# EAGLE design T08_rc360detector_alt (EAGLE 7.4.0)
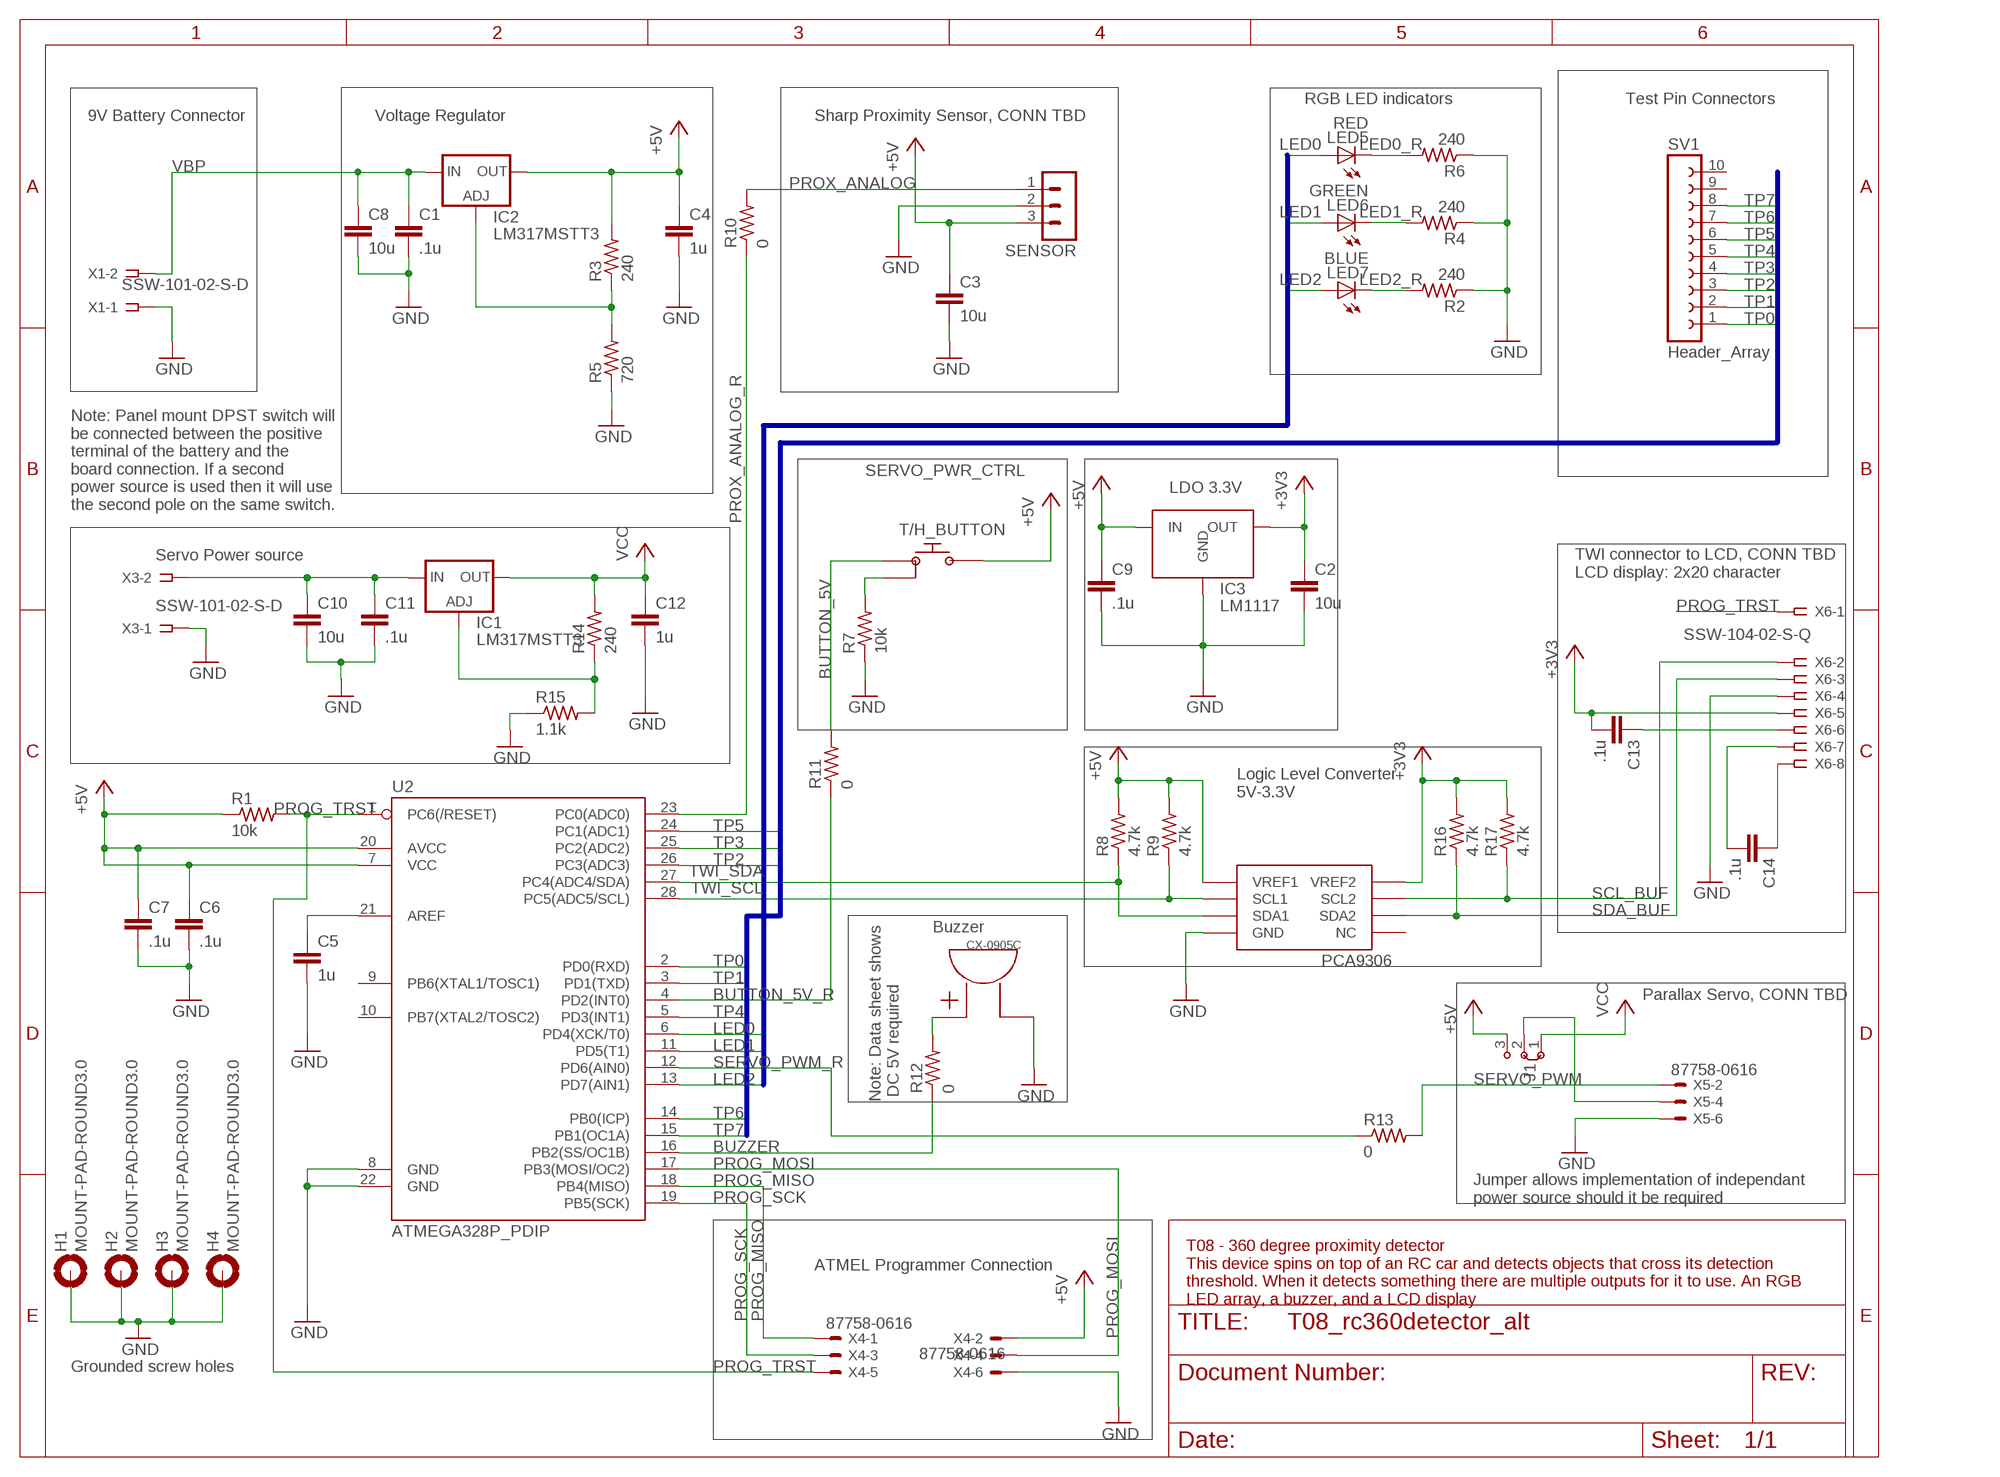
[diagram p0: schematic, sheet 1]

## Parts
C1  .1u  C-EUC0805  [C0805]
C2  10u  C-EUC0805  [C0805]
C3  10u  C-EUC0805  [C0805]
C4  1u  C-EUC0805  [C0805]
C5  1u  C-EUC0805  [C0805]
C6  .1u  C-EUC0805  [C0805]
C7  .1u  C-EUC0805  [C0805]
C8  10u  C-EUC0805  [C0805]
C9  .1u  C-EUC0805  [C0805]
C10  10u  C-EUC0805  [C0805]
C11  .1u  C-EUC0805  [C0805]
C12  1u  C-EUC0805  [C0805]
C13  .1u  C-EUC0805  [C0805]
C14  .1u  C-EUC0805  [C0805]
CX-0905C  CX-0905C  [BUZZER_CX-0905C]
H1  MOUNT-PAD-ROUND3.0  [3,0-PAD]
H2  MOUNT-PAD-ROUND3.0  [3,0-PAD]
H3  MOUNT-PAD-ROUND3.0  [3,0-PAD]
H4  MOUNT-PAD-ROUND3.0  [3,0-PAD]
IC1  LM317MSTT3  [SOT223]
IC2  LM317MSTT3  [SOT223]
IC3  LM1117  [SOT-223]
J1  J2X2MM  [04C]
LED5  RED  LEDLD260  [LD260]
LED6  GREEN  LEDLD260  [LD260]
LED7  BLUE  LEDLD260  [LD260]
PCA9306  PCA9306_BREAKOUT  [PCA9306_BREAKOUT]
R1  10k  R-US_R0805  [R0805]
R2  240  R-US_R0805  [R0805]
R3  240  R-US_R0805  [R0805]
R4  240  R-US_R0805  [R0805]
R5  720  R-US_R0805  [R0805]
R6  240  R-US_R0805  [R0805]
R7  10k  R-US_R0805  [R0805]
R8  4.7k  R-US_R0805  [R0805]
R9  4.7k  R-US_R0805  [R0805]
R10  0  R-US_R0805  [R0805]
R11  0  R-US_R0805  [R0805]
R12  0  R-US_R0805  [R0805]
R13  0  R-US_R0805  [R0805]
R14  240  R-US_R0805  [R0805]
R15  1.1k  R-US_R0805  [R0805]
R16  4.7k  R-US_R0805  [R0805]
R17  4.7k  R-US_R0805  [R0805]
SENSOR  MA03-1  [MA03-1]
SV1  Header_Array  FE10-1  [FE10]
T/H_BUTTON  PR141C  [3_THROUGH_HOLE]
U2  ATMEGA328P_PDIP  [DIL28-3]
X1  SSW-101-02-S-D  [SSW-101-02-S-D]
X3  SSW-101-02-S-D  [SSW-101-02-S-D]
X4  87758-0616  [87758-0616]
X5  87758-0616  [87758-0616]
X6  SSW-104-02-S-Q  [SSW-104-02-S-Q]

## Nets
+3V3: C2.1 C13.2 IC3.VOUT(OUT) PCA9306.VREF2 R16.2 R17.2 X6.5
+5V: C3.1 C4.1 C6.1 C7.1 C9.1 IC2.4(OUT) IC3.IN J1.3 PCA9306.VREF1 R1.1 R3.2 R8.2 R9.2 SENSOR.3 T/H_BUTTON.P$3(OUT) U2.7(VCC) U2.20(AVCC) X4.2
AREF: C5.1 U2.21(AREF)
BUTTON_5V: R11.2 T/H_BUTTON.P$1(IN)
BUTTON_5V_R: R11.1 U2.4(PD2(INT0))
BUZZER: R12.1 U2.16(PB2(SS/OC1B))
GND: C1.2 C2.2 C3.2 C4.2 C5.2 C6.2 C7.2 C8.2 C9.2 C10.2 C11.2 C12.2 CX-0905C.OUT H1.B3,0(MOUNT) H2.B3,0(MOUNT) H3.B3,0(MOUNT) H4.B3,0(MOUNT) IC3.GND PCA9306.GND R2.1 R4.1 R5.1 R6.1 R7.1 R15.1 SENSOR.2 U2.8(GND) U2.22(GND) X1.1 X3.1 X4.6 X5.6 X6.4
LED0: LED5.A U2.6(PD4(XCK/T0))
LED0_R: LED5.K(C) R6.2
LED1: LED6.A U2.11(PD5(T1))
LED1_R: LED6.K(C) R4.2
LED2: LED7.A U2.13(PD7(AIN1))
LED2_R: LED7.K(C) R2.2
N$1: R7.2 T/H_BUTTON.P$2(GND)
N$2: IC2.1(ADJ) R3.1 R5.2
N$4: CX-0905C.IN R12.2
N$13: IC1.1(ADJ) R14.1 R15.2
N$14: C10.1 C11.1 IC1.3(IN) X3.2
N$16: J1.2 X5.4
N$18: C13.1 X6.6
N$19: C14.2 X6.7
N$20: C14.1 X6.8
PROG_MISO: U2.18(PB4(MISO)) X4.1
PROG_MOSI: U2.17(PB3(MOSI/OC2)) X4.4
PROG_SCK: U2.19(PB5(SCK)) X4.3
PROG_TRST: R1.2 U2.1(PC6(/RESET)) X4.5 X6.1
PROX_ANALOG: R10.2 SENSOR.1
PROX_ANALOG_R: R10.1 U2.23(PC0(ADC0))
SCL_BUF: PCA9306.SCL2 R17.1 X6.2
SDA_BUF: PCA9306.SDA2 R16.1 X6.3
SERVO_PWM: R13.2 X5.2
SERVO_PWM_R: R13.1 U2.12(PD6(AIN0))
TP0: SV1.1 U2.2(PD0(RXD))
TP1: SV1.2 U2.3(PD1(TXD))
TP2: SV1.3 U2.26(PC3(ADC3))
TP3: SV1.4 U2.25(PC2(ADC2))
TP4: SV1.5 U2.5(PD3(INT1))
TP5: SV1.6 U2.24(PC1(ADC1))
TP6: SV1.7 U2.14(PB0(ICP))
TP7: SV1.8 U2.15(PB1(OC1A))
TWI_SCL: PCA9306.SCL1 R9.1 U2.28(PC5(ADC5/SCL))
TWI_SDA: PCA9306.SDA1 R8.1 U2.27(PC4(ADC4/SDA))
VBP: C1.1 C8.1 IC2.3(IN) X1.2
VCC: C12.1 IC1.4(OUT) J1.1 R14.2
Unconnected: PCA9306.NC SV1.9 SV1.10 U2.9(PB6(XTAL1/TOSC1)) U2.10(PB7(XTAL2/TOSC2)) X5.1 X5.3 X5.5

## Buses
LED[0..2]
TP[0..13]

## Notes on the sheet
- RGB LED indicators | Test Pin Connectors
- 9V Battery Connector | Voltage Regulator | Sharp Proximity Sensor, CONN TBD
- SERVO_PWR_CTRL
- LDO 3.3V
- Note: Panel mount DPST switch will
  be connected between the positive
  terminal of the battery and the 
  board connection. If a second 
  power source is used then it will use
  the second pole on the same switch.
- Servo Power source
- TWI connector to LCD, CONN TBD
  LCD display: 2x20 character
- Logic Level Converter
  5V-3.3V
- Buzzer
- Parallax Servo, CONN TBD
- Note: Data sheet shows
   DC 5V required
- Jumper allows implementation of independant 
  power source should it be required
- ATMEL Programmer Connection
- T08 - 360 degree proximity detector
  This device spins on top of an RC car and detects objects that cross its detection
  threshold. When it detects something there are multiple outputs for it to use. An RGB 
  LED array, a buzzer, and a LCD display
- Grounded screw holes

## Library data of the parts
C1 C4 C5 C9 C11-C14 = resistor:C-EU: CAPACITOR, European symbol
C2 C3 C6-C8 C10 = rcl:C-EU: CAPACITOR, European symbol
CX-0905C = 360prox:CX-0905C
H1-H4 = holes:MOUNT-PAD-ROUND: MOUNTING PAD, round
IC1 IC2 = v-reg:LM317?*: 500 mA Adjustable Output Positive Voltage Regulator Source: http://www.onsemi.co.jp .. LM317M-D.PDF
IC3 = 360prox:LM1117
J1 = jumper:J2: Jumper switch 2 x 2.5 mm
LED5-LED7 = led:LED: LED OSRAM: - CHIPLED LG R971, LG N971, LY N971, LG Q971, LY Q971, LO R971, LY R971 LH N974, LH R974 LS Q976, LO Q976, LY Q976 LO Q996 - Hyper CHIPLED LW Q18S LB Q993, LB Q99A, LB R99A - SideLED LS A670, LO A670, LY A670, LG A670, LP A670 LB A673, LV A673, LT A673, LW A673 LH A674 LY A675 LS A676, LA A676, LO A676, LY A676, LW A676 LS A679, LY A679, LG A679 - Hyper Micro SIDELED® LS Y876, LA Y876, LO Y876, LY Y876 LT Y87S - SmartLED LW L88C, LW L88S LB L89C, LB L89S, LG L890 LS L89K, LO L89K, LY L89K LS L896, LA L896, LO L896, LY L896 - TOPLED LS T670, LO T670, LY T670, LG T670, LP T670 LSG T670, LSP T670, LSY T670, LOP T670, LYG T670 LG T671, LOG T671, LSG T671 LB T673, LV T673, LT T673, LW T673 LH T674 LS T676, LA T676, LO T676, LY T676, LB T676, LH T676, LSB T676, LW T676 LB T67C, LV T67C, LT T67C, LS T67K, LO T67K, LY T67K, LW E67C LS E67B, LA E67B, LO E67B, LY E67B, LB E67C, LV E67C, LT E67C LW T67C LS T679, LY T679, LG T679 LS T770, LO T770, LY T770, LG T770, LP T770 LB T773, LV T773, LT T773, LW T773 LH T774 LS E675, LA E675, LY E675, LS T675 LS T776, LA T776, LO T776, LY T776, LB T776 LHGB T686 LT T68C, LB T68C - Hyper Mini TOPLED® LB M676 - Mini TOPLED Santana® LG M470 LS M47K, LO M47K, LY M47K Source: http://www.osram.convergy.de LUXEON: - LUMILED® LXK2-PW12-R00, LXK2-PW12-S00, LXK2-PW14-U00, LXK2-PW14-V00 LXK2-PM12-R00, LXK2-PM12-S00, LXK2-PM14-U00 LXK2-PE12-Q00, LXK2-PE12-R00, LXK2-PE12-S00, LXK2-PE14-T00, LXK2-PE14-U00 LXK2-PB12-K00, LXK2-PB12-L00, LXK2-PB12-M00, LXK2-PB14-N00, LXK2-PB14-P00, LXK2-PB14-Q00 LXK2-PR12-L00, LXK2-PR12-M00, LXK2-PR14-Q00, LXK2-PR14-R00 LXK2-PD12-Q00, LXK2-PD12-R00, LXK2-PD12-S00 LXK2-PH12-R00, LXK2-PH12-S00 LXK2-PL12-P00, LXK2-PL12-Q00, LXK2-PL12-R00 Source: www.luxeon.com KINGBRIGHT: KA-3528ASYC Source: www.kingbright.com
PCA9306 = 360prox:PCA9306_BREAKOUT
R1-R17 = rcl:R-US_: RESISTOR, American symbol
SENSOR = con-lstb:MA03-1: PIN HEADER; OC_FARNELL: unknown; OC_NEWARK: unknown
SV1 = con-lsta:FE10-1: FEMALE HEADER; OC_FARNELL: unknown; OC_NEWARK: unknown
T/H_BUTTON = 360prox:PR141C
U2 = SparkFun-DigitalIC:ATMEGA328P_PDIP: uC used in the Arduino 32kb flash, 1k EEPROM, 2k SRAM This is the through-hole version of this chip.
X1 X3 = con-samtec:SSW-101-02-S-D: THROUGH-HOLE .025" SQ POST SOCKET Source: Samtec SSW.pdf; MPN: SSW-101-02-S-D; OC_FARNELL: unknown; OC_NEWARK: 82P1456
X4 X5 = con-molex:87758-0616: 6 Pin - 2mm Dual Row Single Wafer, Vertical T/H HDR Source: http://www.molex.com/pdm_docs/sd/877580616_sd.pdf; MPN: 87758-0616; OC_FARNELL: 7472323; OC_NEWARK: 25M5667
X6 = con-samtec:SSW-104-02-S-Q: THROUGH-HOLE .025" SQ POST SOCKET Source: Samtec SSW.pdf; MPN: SSW-104-02-S-Q; OC_FARNELL: unknown; OC_NEWARK: 82P2475

## Board
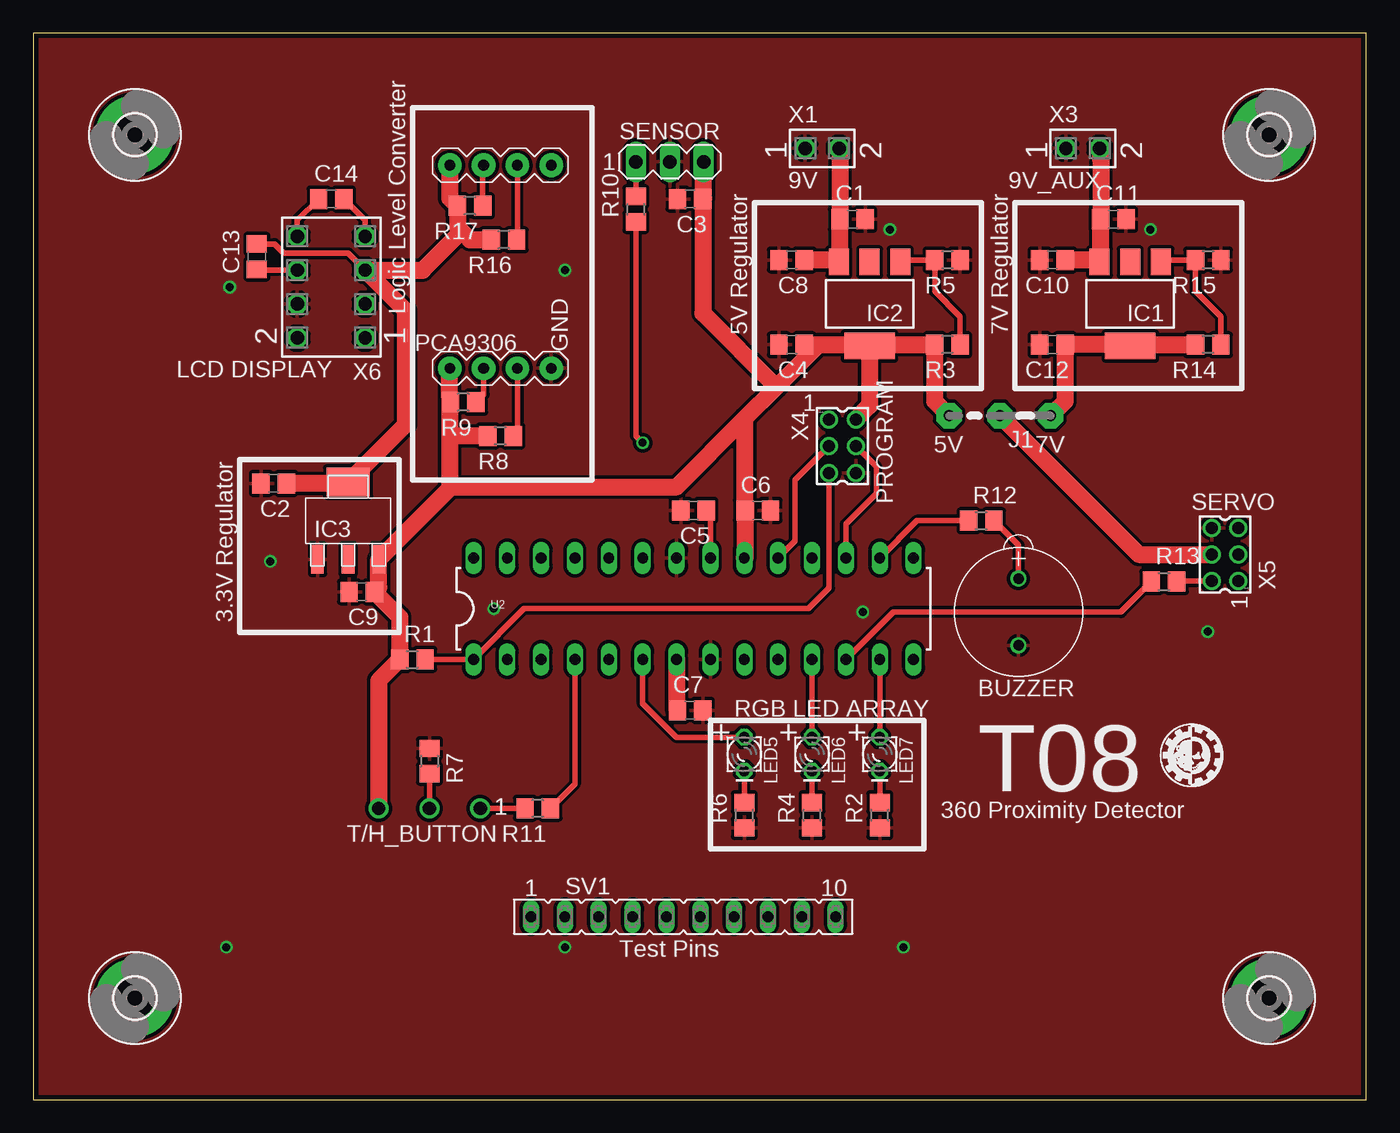
[diagram p1: board, top side]
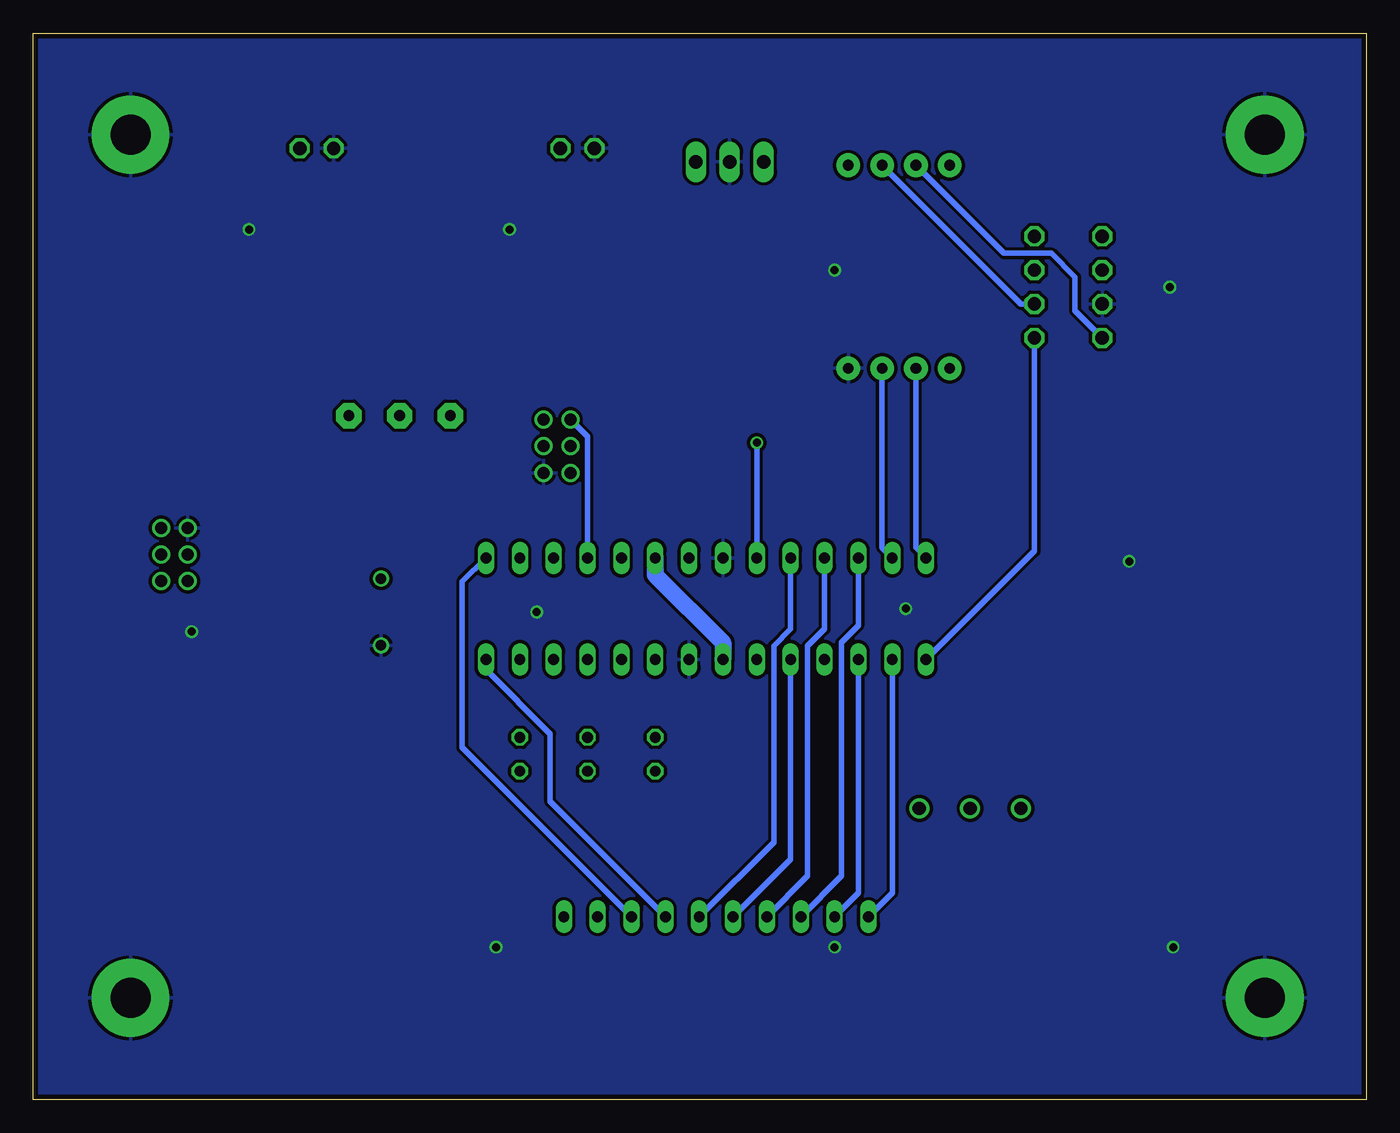
[diagram p2: board, bottom side, seen from below]

Size 100 x 80 mm. Coordinates in mm from the lower left corner, seen from the top.
Outline: 0,0 100,0 100,80 0,80 0,0
Copper layers (1*16): Top 0.0356mm / dielectric 1.5011mm / Bottom 0.0356mm
Design rules "OSH-Park-2-layer": minimum track width 6mil, minimum drill 13mil, track to track 6mil, track to pad 6mil, pad to pad 6mil, via to via 6mil, smd to smd 6mil, copper to edge 15mil, drill to drill 6mil, minimum pad ring 7mil, minimum via ring 7mil, stop-mask expansion 3mil, vias tented up to drill 0mil, thermal gap 10mil

### Footprints (pad centres in the part's own frame; a part is rotated, then mirrored left to right if it is on the bottom)
C0805 = smd 1.3 x 1.5: 1 -0.95,0; 2 0.95,0
BUZZER_CX-0905C = drill 0.8: IN 0,2.5; OUT 0,-2.5
3,0-PAD = drill 3 pad 5.842: B3,0 0,0
SOT223 = smd 1.5 x 2: 1 -2.3,-3.15; 2 0,-3.15; 3 2.3,-3.15 | smd 3.8 x 2: 4 0,3.15
SOT-223 = smd 0.95 x 2.15: GND -2.3,-2.9; IN 2.3,-2.9; OUT 0,-2.9 | smd 3.25 x 2.15: VOUT 0,2.9
04C = drill 0.813 pad 1.905 octagon: 1 -1.905,0; 2 1.905,0; 3 5.715,0
LD260 = drill 0.813 octagon: A -1.27,0; K 1.27,0
PCA9306_BREAKOUT = drill 0.8 pad 1.778: GND 1.27,1.27; NC 16.51,1.27; SCL1 1.27,6.35; SCL2 16.51,6.35; SDA1 1.27,3.81; SDA2 16.51,3.81; VREF1 1.27,8.89; VREF2 16.51,8.89
R0805 = smd 1.3 x 1.5: 1 -0.95,0; 2 0.95,0
MA03-1 = drill 1.016 long: 1 -2.54,0; 2 0,0; 3 2.54,0
FE10 = drill 0.813 long: 1 -11.43,0; 2 -8.89,0; 3 -6.35,0; 4 -3.81,0; 5 -1.27,0; 6 1.27,0; 7 3.81,0; 8 6.35,0; 9 8.89,0; 10 11.43,0
3_THROUGH_HOLE = drill 1: P$1 0,0; P$2 3.81,0; P$3 7.62,0
DIL28-3 = drill 0.813 long: 1 -16.51,-3.81; 2 -13.97,-3.81; 3 -11.43,-3.81; 4 -8.89,-3.81; 5 -6.35,-3.81; 6 -3.81,-3.81; 7 -1.27,-3.81; 8 1.27,-3.81; 9 3.81,-3.81; 10 6.35,-3.81; 11 8.89,-3.81; 12 11.43,-3.81; 13 13.97,-3.81; 14 16.51,-3.81; 15 16.51,3.81; 16 13.97,3.81; 17 11.43,3.81; 18 8.89,3.81; 19 6.35,3.81; 20 3.81,3.81; 21 1.27,3.81; 22 -1.27,3.81; 23 -3.81,3.81; 24 -6.35,3.81; 25 -8.89,3.81; 26 -11.43,3.81; 27 -13.97,3.81; 28 -16.51,3.81
SSW-101-02-S-D = drill 1 pad 1.5 octagon: 1 0,-1.27; 2 0,1.27
87758-0616 = drill 0.9 pad 1.27: 1 -2,-1; 2 -2,1; 3 0,-1; 4 0,1; 5 2,-1; 6 2,1
SSW-104-02-S-Q = drill 1 pad 1.5 octagon: 1 -3.81,-2.54; 2 -3.81,2.54; 3 -1.27,-2.54; 4 -1.27,2.54; 5 1.27,-2.54; 6 1.27,2.54; 7 3.81,-2.54; 8 3.81,2.54

### Placement (x,y rotation side)
C1  61.47,66.04 0 top
C2  18.03,46.23 180 top
C3  49.28,67.56 180 top
C4  56.9,56.64 180 top
C5  49.53,44.2 180 top
C6  54.36,44.2 0 top
C7  49.28,29.21 0 top
C8  56.9,62.99 180 top
C9  24.64,38.1 180 top
C10  76.45,62.99 180 top
C11  81.03,66.04 0 top
C12  76.45,56.64 180 top
C13  16.76,63.25 90 top
C14  22.35,67.56 0 top
CX-0905C  73.91,36.58 0 top
H1  92.71,72.39 0 top
H2  92.71,7.62 0 top
H3  7.62,72.39 0 top
H4  7.62,7.62 0 top
IC1  82.3,59.69 180 top
IC2  62.74,59.69 180 top
IC3  23.62,43.43 0 top
J1  74.42,51.31 180 top
LED5  53.34,25.91 270 top
LED6  58.42,25.91 270 top
LED7  63.5,25.91 270 top
PCA9306  40.13,53.59 90 top
R1  28.45,33.02 0 top
R2  63.5,21.34 90 top
R3  68.58,56.64 180 top
R4  58.42,21.34 90 top
R5  68.58,62.99 180 top
R6  53.34,21.34 90 top
R7  29.72,25.4 270 top
R8  35.05,49.78 180 top
R9  32.26,52.32 180 top
R10  45.21,66.8 90 top
R11  37.85,21.84 180 top
R12  71.12,43.43 0 top
R13  84.84,38.86 0 top
R14  88.14,56.64 180 top
R15  88.14,62.99 180 top
R16  35.31,64.52 180 top
R17  32.77,67.06 180 top
SENSOR  47.75,70.36 0 top
SV1  48.77,13.72 0 top
T/H_BUTTON  33.53,21.84 180 top
U2  49.53,36.83 0 top
X1  59.18,71.37 270 top
X3  78.74,71.37 270 top
X4  60.71,49.02 270 top
X5  89.41,40.89 90 top
X6  22.35,60.96 90 top

### Tracks (layer width: path | path; a pad name or v marks a point on that pad's centre or on a via)
+3V3
  Top 0.406: C13.2 18.1,64.2 18.8,63.5 23.62,63.5 X6.5
  Top 1.27: C2.1 23.52,46.23 IC3.VOUT 27.94,50.65 27.94,59.18 X6.5 29.21,62.23 32.13,65.15 | PCA9306.VREF2 31.24,67.63 R17.2 31.82,65.47 32.13,65.15 | 32.13,65.15 32.77,64.52 R16.2
+5V
  Top 1.27: T/H_BUTTON.P$3 25.91,31.43 R1.1 27.5,36.19 C9.1 25.92,38.43 IC3.IN 31.36,45.97 | PCA9306.VREF1 31.24,52.64 R9.2 31.24,52.26 31.24,49.78 | SENSOR.3 50.29,67.63 C3.1 50.23,58.99 55.75,53.47 | IC2.4 62.84,56.64 | 62.84,56.64 R3.2 67.63,52.38 J1.3 | 62.48,56.64 62.84,56.64 | C4.1 58.93,56.64 | 58.93,56.64 62.48,56.64 | 62.48,56.64 62.74,56.39 62.74,52.05 X4.2 | 53.41,51.12 C6.1 53.41,40.71 U2.20 | 53.41,51.12 55.75,53.47 | 55.75,53.47 58.93,56.64 | U2.7 48.26,29.28 C7.1 | 31.24,49.78 31.24,46.09 31.36,45.97 | 31.36,45.97 48.26,45.97 53.41,51.12 | R8.2 31.24,49.78
  Bottom 1.27: U2.20 53.34,39.37 48.26,34.29 U2.7
AREF
  Top 0.406: U2.21 50.8,44.13 C5.1
BUTTON_5V
  Top 0.406: T/H_BUTTON.P$1 R11.2
BUTTON_5V_R
  Top 0.406: U2.4 40.64,23.69 R11.1
BUZZER
  Top 0.406: R12.1 66.29,43.43 U2.16
GND  (via drill 0.6)
  other vias: 39.88,62.23 14.73,60.96 17.78,40.39 14.48,11.43 39.88,11.43 65.28,11.43 88.11,35.1 83.82,65.28 64.26,65.28 34.54,36.83 62.23,36.58
  pour Top (isolate 0.254): 0,0 99.82,0 99.82,79.76 0,79.76
  pour Bottom (isolate 0.254): 0,0 99.82,0 99.82,79.76 0,79.76
LED0
  Top 0.406: LED5.A 48.26,27.18 45.72,29.72 U2.6
LED0_R
  Top 0.406: R6.2 LED5.K
LED1
  Top 0.406: LED6.A U2.11
LED1_R
  Top 0.406: R4.2 LED6.K
LED2
  Top 0.406: LED7.A U2.13
LED2_R
  Top 0.406: R2.2 LED7.K
N$1
  Top 0.406: R7.2 T/H_BUTTON.P$2
N$2
  Top 0.406: IC2.1 65.19,62.99 R5.2 67.63,60.64 69.53,58.74 R3.1
N$4
  Top 0.406: R12.2 73.91,41.59 CX-0905C.IN
N$13
  Top 0.406: 84.75,62.99 R15.2 87.19,60.64 89.09,58.74 R14.1
  Top 1.27: IC1.1 84.75,62.99
N$14
  Top 1.27: C10.1 79.84,62.99 IC1.3 80.08,62.92 C11.1 80.08,70.55 X3.2
N$16
  Top 1.27: J1.2 82.93,40.89 X5.4
N$18
  Top 0.406: X6.6 16.83,62.23 C13.1
N$19
  Top 0.406: X6.7 24.89,65.97 C14.2
N$20
  Top 0.406: C14.1 19.81,65.97 X6.8
PROG_MISO
  Bottom 0.406: U2.18 58.42,49.74 X4.1
PROG_MOSI
  Top 0.406: U2.17 60.96,43.18 63.25,45.47 63.25,47.48 X4.4
PROG_SCK
  Top 0.406: U2.19 57.15,41.91 57.15,46.47 X4.3
PROG_TRST
  Top 0.406: R1.2 U2.1 36.83,36.83 58.17,36.83 59.71,38.37 X4.5
  Bottom 0.406: X6.1 24.89,41.15 U2.1
PROX_ANALOG
  Top 0.406: SENSOR.1 R10.2
PROX_ANALOG_R  (via drill 0.6)
  Top 0.406: v45.72,49.28 45.21,49.78 R10.1
  Bottom 0.406: U2.23 v45.72,49.28
SCL_BUF
  Top 0.406: PCA9306.SCL2 33.72,70.04 R17.1
  Bottom 0.406: PCA9306.SCL2 27.18,63.5 23.62,63.5 21.84,61.72 21.84,59.18 X6.2
SDA_BUF
  Top 0.406: R16.1 36.32,64.58 PCA9306.SDA2
  Bottom 0.406: PCA9306.SDA2 25.91,59.69 X6.3
SERVO_PWM
  Top 0.406: R13.2 85.82,38.89 X5.2
SERVO_PWM_R
  Top 0.406: R13.1 81.6,36.58 64.52,36.58 U2.12
TP0
  Bottom 0.406: U2.2 35.56,15.49 SV1.1
TP1
  Bottom 0.406: U2.3 38.1,15.49 SV1.2
TP2
  Bottom 0.406: U2.26 38.1,35.56 39.37,34.29 39.37,16.76 SV1.3
TP3
  Bottom 0.406: U2.25 40.64,35.31 41.91,34.04 41.91,16.76 SV1.4
TP4
  Bottom 0.406: U2.5 43.18,18.03 SV1.5
TP5
  Bottom 0.406: U2.24 43.18,35.31 44.45,34.04 44.45,19.3 SV1.6
TP6
  Bottom 0.406: SV1.7 61.21,22.35 61.21,27.43 66.04,32.26 U2.14
TP7
  Bottom 0.406: U2.15 67.82,38.86 67.82,26.42 SV1.8
TWI_SCL
  Top 0.406: R9.1 33.78,52.9 PCA9306.SCL1
  Bottom 0.406: U2.28 33.78,41.4 PCA9306.SCL1
TWI_SDA
  Top 0.406: PCA9306.SDA1 36.32,50.1 R8.1
  Bottom 0.406: U2.27 36.32,41.4 PCA9306.SDA1
VBP
  Top 1.27: C8.1 60.29,62.99 IC2.3 60.52,62.92 C1.1 60.52,71.31 X1.2
VCC
  Top 1.27: R14.2 82.4,56.64 IC1.4 82.19,56.64 C12.1 77.4,52.38 J1.1

### Text on the board
tPlace: 9V | 9V_AUX | Logic Level Converter | 5V Regulator | 7V Regulator | LCD DISPLAY | 1 | 5V | 7V | PROGRAM | SERVO | 1 | 3.3V Regulator | BUZZER | RGB LED ARRAY | + | + | + | T08 | 360 Proximity Detector | Test Pins